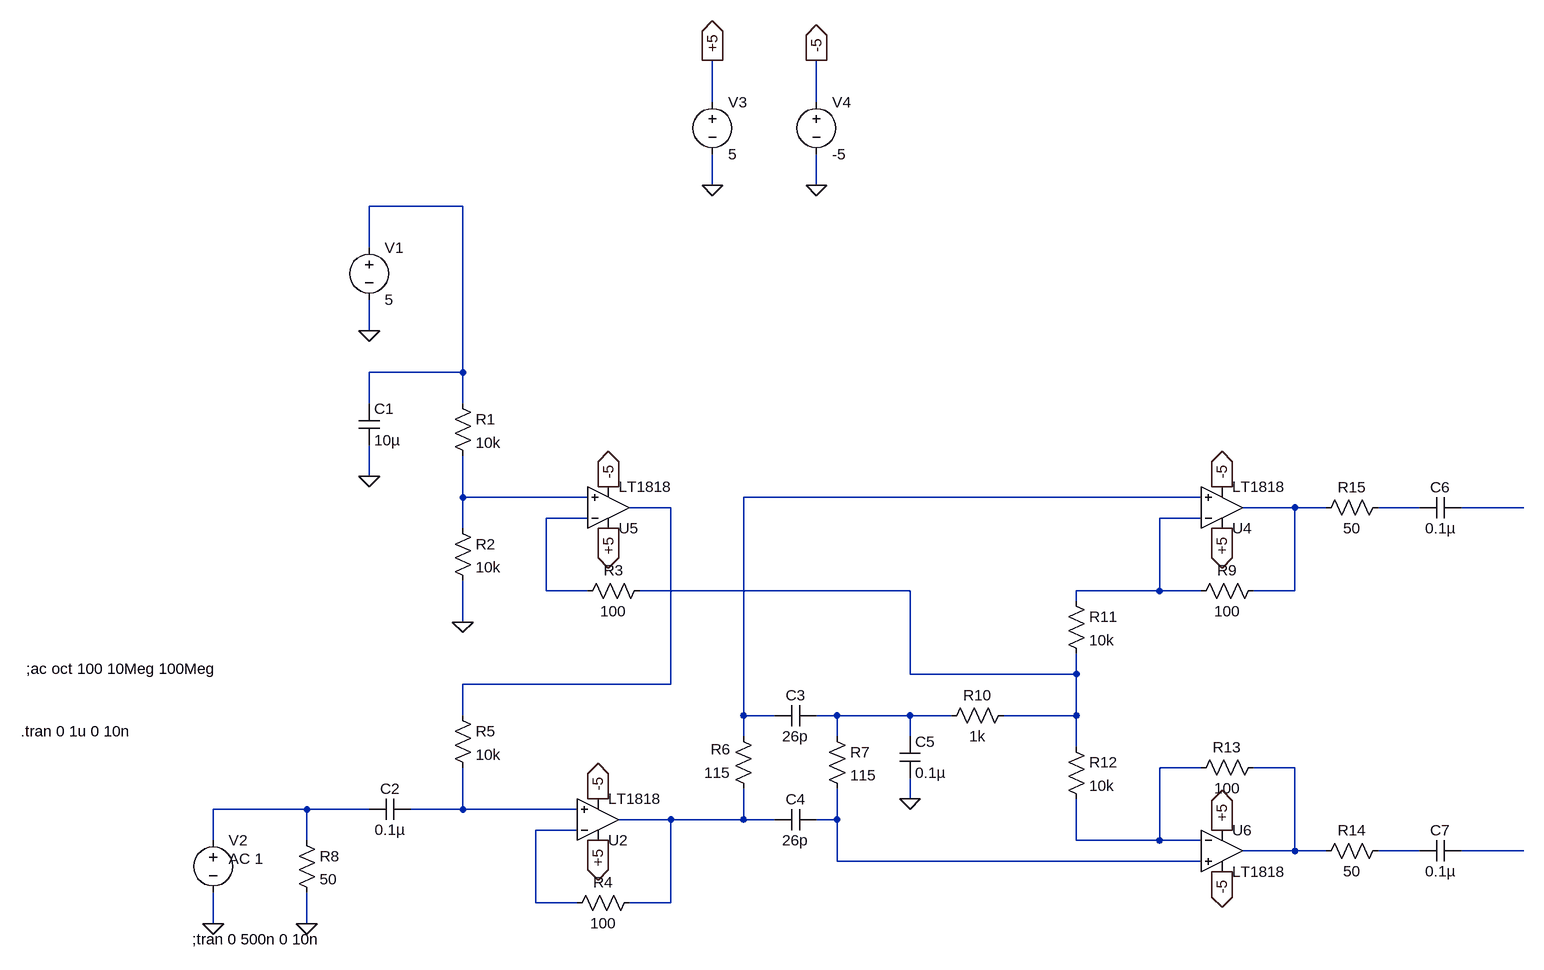
[diagram p0: schematic I-Q Generator.asc]
I-Q Generator.asc, the LTspice schematic file:
Version 4
SHEET 1 1444 816
WIRE 192 -512 192 -576
WIRE 352 -512 352 -576
WIRE 192 -384 192 -432
WIRE 352 -384 352 -432
WIRE -192 -352 -336 -352
WIRE -336 -288 -336 -352
WIRE -336 -160 -336 -208
WIRE -192 -96 -192 -352
WIRE -192 -96 -336 -96
WIRE -336 -48 -336 -96
WIRE -192 -48 -192 -96
WIRE -336 64 -336 16
WIRE -192 96 -192 32
WIRE 0 96 -192 96
WIRE 944 96 240 96
WIRE 128 112 64 112
WIRE 1088 112 1008 112
WIRE 1136 112 1088 112
WIRE 1280 112 1216 112
WIRE 1440 112 1344 112
WIRE 0 128 -64 128
WIRE 944 128 880 128
WIRE -192 144 -192 96
WIRE -64 240 -64 128
WIRE 0 240 -64 240
WIRE 496 240 80 240
WIRE 880 240 880 128
WIRE 880 240 752 240
WIRE 944 240 880 240
WIRE 1088 240 1088 112
WIRE 1088 240 1024 240
WIRE 752 256 752 240
WIRE -192 288 -192 224
WIRE 496 368 496 240
WIRE 752 368 752 336
WIRE 752 368 496 368
WIRE 128 384 128 112
WIRE 128 384 -192 384
WIRE -192 432 -192 384
WIRE 240 432 240 96
WIRE 288 432 240 432
WIRE 384 432 352 432
WIRE 496 432 384 432
WIRE 560 432 496 432
WIRE 752 432 752 368
WIRE 752 432 640 432
WIRE 240 464 240 432
WIRE 384 464 384 432
WIRE 496 464 496 432
WIRE 752 480 752 432
WIRE 944 512 880 512
WIRE 1088 512 1024 512
WIRE 496 560 496 528
WIRE -432 576 -576 576
WIRE -336 576 -432 576
WIRE -192 576 -192 512
WIRE -192 576 -272 576
WIRE -16 576 -192 576
WIRE 128 592 48 592
WIRE 240 592 240 544
WIRE 240 592 128 592
WIRE 288 592 240 592
WIRE 384 592 384 544
WIRE 384 592 352 592
WIRE -16 608 -80 608
WIRE -576 624 -576 576
WIRE -432 624 -432 576
WIRE 752 624 752 560
WIRE 880 624 880 512
WIRE 880 624 752 624
WIRE 944 624 880 624
WIRE 1088 640 1088 512
WIRE 1088 640 1008 640
WIRE 1136 640 1088 640
WIRE 1280 640 1216 640
WIRE 1440 640 1344 640
WIRE 384 656 384 592
WIRE 944 656 384 656
WIRE -80 720 -80 608
WIRE -16 720 -80 720
WIRE 128 720 128 592
WIRE 128 720 64 720
WIRE -576 752 -576 704
WIRE -432 752 -432 704
FLAG -192 288 0
FLAG -336 64 0
FLAG -336 -160 0
FLAG -576 752 0
FLAG 192 -384 0
FLAG 352 -384 0
FLAG 192 -576 +5
IOPIN 192 -576 Out
FLAG 352 -576 -5
IOPIN 352 -576 Out
FLAG 32 144 +5
IOPIN 32 144 Out
FLAG 32 80 -5
IOPIN 32 80 Out
FLAG 16 624 +5
IOPIN 16 624 Out
FLAG 16 560 -5
IOPIN 16 560 Out
FLAG 976 608 +5
IOPIN 976 608 Out
FLAG 976 672 -5
IOPIN 976 672 Out
FLAG 976 144 +5
IOPIN 976 144 Out
FLAG 976 80 -5
IOPIN 976 80 Out
FLAG 496 560 0
FLAG -432 752 0
SYMBOL res -208 -64 R0
SYMATTR InstName R1
SYMATTR Value 10k
SYMBOL res -208 128 R0
SYMATTR InstName R2
SYMATTR Value 10k
SYMBOL cap -352 -48 R0
SYMATTR InstName C1
SYMATTR Value 10µ
SYMBOL voltage -336 -304 R0
WINDOW 123 0 0 Left 0
WINDOW 39 0 0 Left 0
SYMATTR InstName V1
SYMATTR Value 5
SYMBOL res 96 224 R90
WINDOW 0 0 56 VBottom 2
WINDOW 3 32 56 VTop 2
SYMATTR InstName R3
SYMATTR Value 100
SYMBOL res 80 704 R90
WINDOW 0 0 56 VBottom 2
WINDOW 3 32 56 VTop 2
SYMATTR InstName R4
SYMATTR Value 100
SYMBOL res -208 416 R0
SYMATTR InstName R5
SYMATTR Value 10k
SYMBOL cap -272 560 R90
WINDOW 0 0 32 VBottom 2
WINDOW 3 32 32 VTop 2
SYMATTR InstName C2
SYMATTR Value 0.1µ
SYMBOL voltage -576 608 R0
WINDOW 3 24 96 Invisible 2
WINDOW 123 24 44 Left 2
WINDOW 39 0 0 Left 0
SYMATTR Value SINE(0 1 50Meg 0 0 0)
SYMATTR Value2 AC 1
SYMATTR InstName V2
SYMBOL voltage 192 -528 R0
WINDOW 123 0 0 Left 0
WINDOW 39 0 0 Left 0
SYMATTR InstName V3
SYMATTR Value 5
SYMBOL voltage 352 -528 R0
WINDOW 123 0 0 Left 0
WINDOW 39 0 0 Left 0
SYMATTR InstName V4
SYMATTR Value -5
SYMBOL res 256 560 R180
WINDOW 0 36 76 Left 2
WINDOW 3 36 40 Left 2
SYMATTR InstName R6
SYMATTR Value 115
SYMBOL cap 352 416 R90
WINDOW 0 0 32 VBottom 2
WINDOW 3 32 32 VTop 2
SYMATTR InstName C3
SYMATTR Value 26p
SYMBOL res 368 448 R0
SYMATTR InstName R7
SYMATTR Value 115
SYMBOL cap 352 576 R90
WINDOW 0 0 32 VBottom 2
WINDOW 3 32 32 VTop 2
SYMATTR InstName C4
SYMATTR Value 26p
SYMBOL res 1040 224 R90
WINDOW 0 0 56 VBottom 2
WINDOW 3 32 56 VTop 2
SYMATTR InstName R9
SYMATTR Value 100
SYMBOL cap 480 464 R0
SYMATTR InstName C5
SYMATTR Value 0.1µ
SYMBOL res 736 240 R0
SYMATTR InstName R11
SYMATTR Value 10k
SYMBOL res 736 464 R0
SYMATTR InstName R12
SYMATTR Value 10k
SYMBOL res 1040 496 R90
WINDOW 0 0 56 VBottom 2
WINDOW 3 32 56 VTop 2
SYMATTR InstName R13
SYMATTR Value 100
SYMBOL res 1232 624 R90
WINDOW 0 0 56 VBottom 2
WINDOW 3 32 56 VTop 2
SYMATTR InstName R14
SYMATTR Value 50
SYMBOL res 1232 96 R90
WINDOW 0 0 56 VBottom 2
WINDOW 3 32 56 VTop 2
SYMATTR InstName R15
SYMATTR Value 50
SYMBOL res -448 608 R0
SYMATTR InstName R8
SYMATTR Value 50
SYMBOL cap 1344 96 R90
WINDOW 0 0 32 VBottom 2
WINDOW 3 32 32 VTop 2
SYMATTR InstName C6
SYMATTR Value 0.1µ
SYMBOL cap 1280 624 M90
WINDOW 0 0 32 VBottom 2
WINDOW 3 32 32 VTop 2
SYMATTR InstName C7
SYMATTR Value 0.1µ
SYMBOL res 656 416 R90
WINDOW 0 0 56 VBottom 2
WINDOW 3 32 56 VTop 2
SYMATTR InstName R10
SYMATTR Value 1k
SYMBOL Opamps\\LT1818 32 112 M180
SYMATTR InstName U5
SYMBOL Opamps\\LT1818 16 592 M180
SYMATTR InstName U2
SYMBOL Opamps\\LT1818 976 112 M180
SYMATTR InstName U4
SYMBOL Opamps\\LT1818 976 640 R0
SYMATTR InstName U6
TEXT -608 776 Left 2 !;tran 0 500n 0 10n
TEXT -872 456 Left 2 !.tran 0 1u 0 10n
TEXT -864 360 Left 2 !;ac oct 100 10Meg 100Meg

The netlist it stands for:
* I-Q Generator.asc
R1 N001 N002 10k
R2 N002 0 10k
C1 N001 0 10µ
V1 N001 0 5
R3 N010 N008 100
R4 N016 N018 100
R5 N004 N015 10k
C2 N015 N014 0.1µ
V2 N014 0 SINE(0 1 50Meg 0 0 0) AC 1
V3 +5 0 5
V4 -5 0 -5
R6 N016 N003 115
C3 N011 N003 26p
R7 N011 N017 115
C4 N017 N016 26p
R9 N005 N009 100
C5 N011 0 0.1µ
R11 N009 N010 10k
R12 N010 N012 10k
R13 N013 N012 100
R14 N019 N013 50
R15 N006 N005 50
R8 N014 0 50
C6 N007 N006 0.1µ
C7 N019 N020 0.1µ
R10 N010 N011 1k
XU5 N002 N008 N004 +5 -5 LT1818  ; pins In+ In- OUT V+ V-
XU2 N015 N018 N016 +5 -5 LT1818  ; pins In+ In- OUT V+ V-
XU4 N003 N009 N005 +5 -5 LT1818  ; pins In+ In- OUT V+ V-
XU6 N017 N012 N013 +5 -5 LT1818  ; pins In+ In- OUT V+ V-
;tran 0 500n 0 10n
.tran 0 1u 0 10n
;ac oct 100 10Meg 100Meg
.lib LTC2.lib
.backanno
.end